# EAGLE schematic OSPID IO Board (EAGLE 6.4)
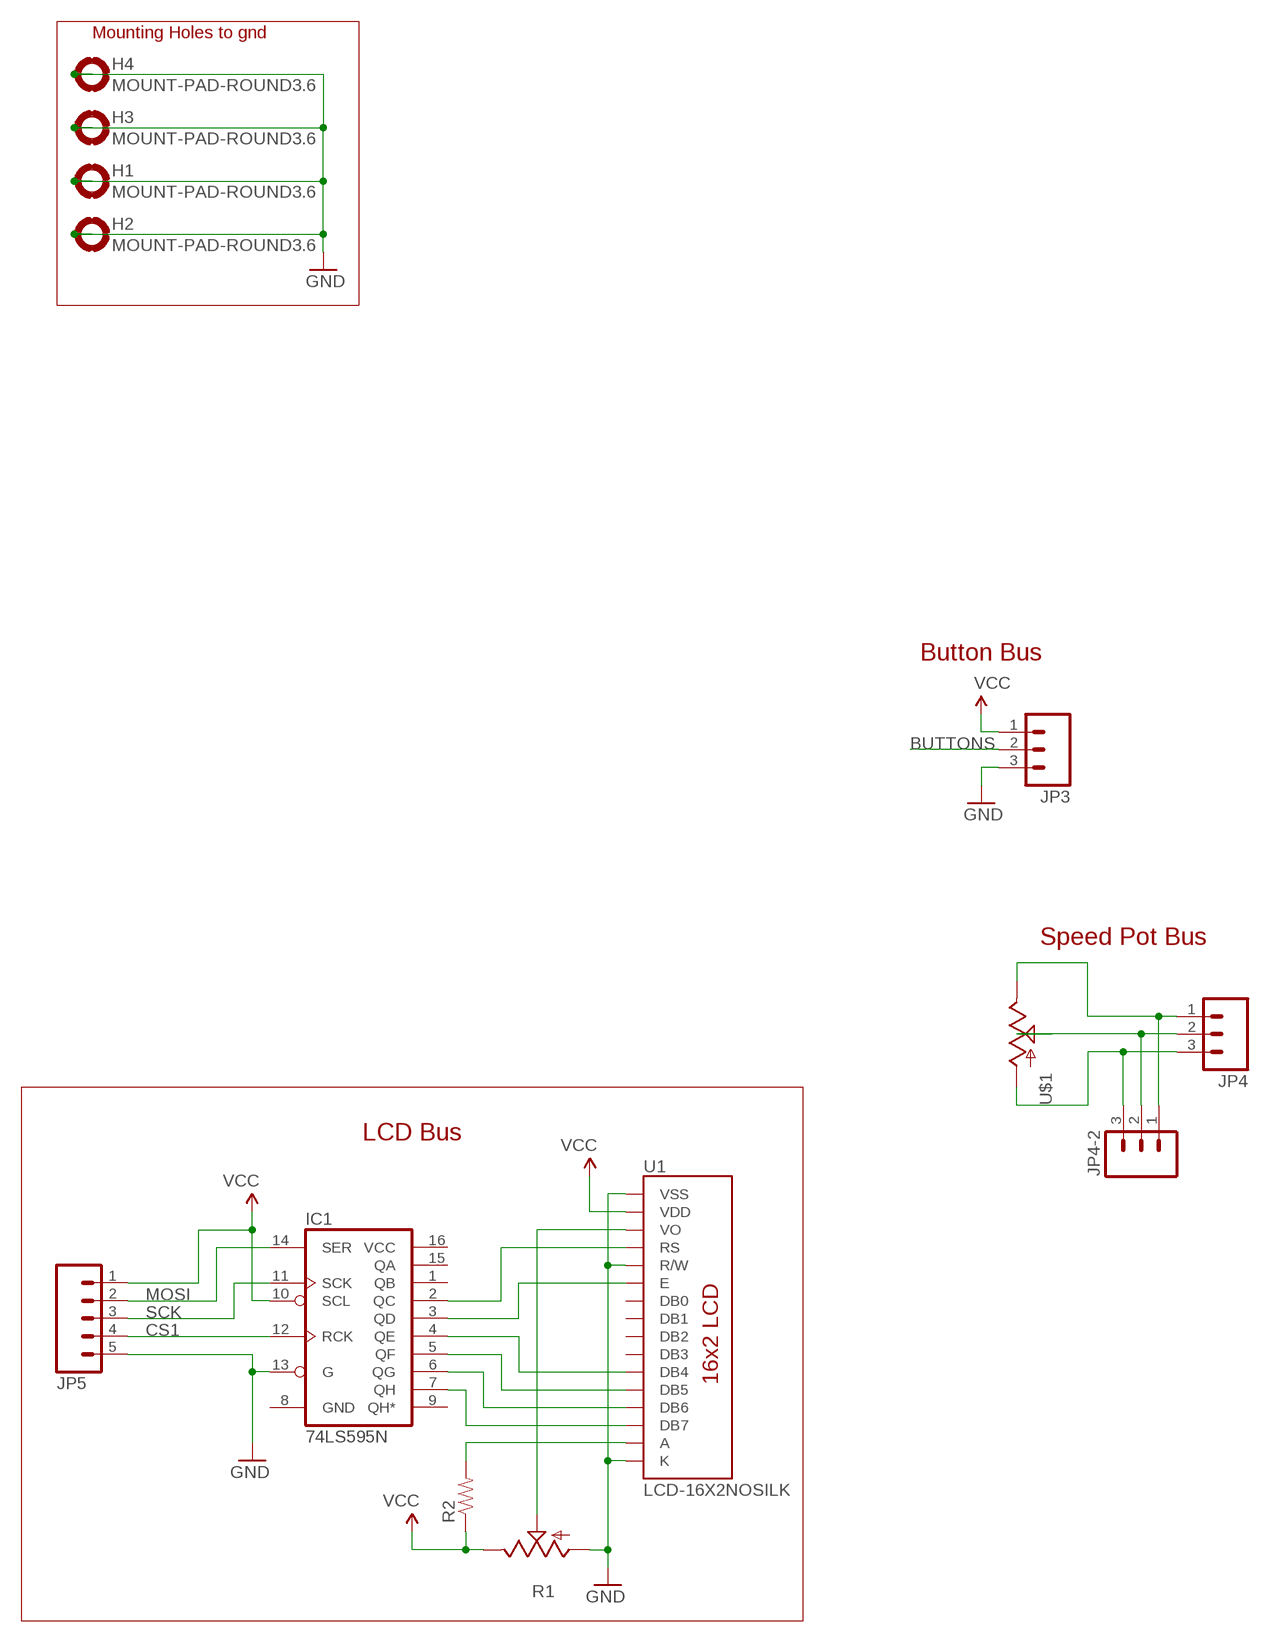
[diagram p0: schematic, sheet 1]

## Parts
H1  MOUNT-PAD-ROUND3.6  [3,6-PAD]
H2  MOUNT-PAD-ROUND3.6  [3,6-PAD]
H3  MOUNT-PAD-ROUND3.6  [3,6-PAD]
H4  MOUNT-PAD-ROUND3.6  [3,6-PAD]
IC1  74LS595N  [DIL16]
JP3  M03LOCK  [1X03_LOCK]
JP4  M03LOCK  [1X03_LOCK]
JP4-2  M03LOCK  [1X03_LOCK]
JP5  M05LOCK  [1X05_LOCK]
R1  POT_TRIM_US-B25U  [POT_B25U]
R2  RESISTORAXIAL-0.3  [AXIAL-0.3]
U1  LCD-16X2NOSILK  [LCD-16X2_NOSILK]
U$1  POT  [ALPS_POT]

## Nets
BUTTONS: JP3.2
CS1: IC1.12(RCK) JP5.4
GND: H1.B3,6(MOUNT) H2.B3,6(MOUNT) H3.B3,6(MOUNT) H4.B3,6(MOUNT) IC1.13(G) JP3.3 JP5.5 R1.A U1.1(VSS) U1.5(R/W) U1.16(K)
MOSI: IC1.14(SER) JP5.2
N$1: JP4-2.3 JP4.3 U$1.P$3(A)
N$2: R2.P$2 U1.15(A)
N$3: JP4-2.2 JP4.2 U$1.P$2(S)
N$4: JP4-2.1 JP4.1 U$1.P$1(E)
N$5: IC1.4(QE) U1.11(DB4)
N$6: IC1.2(QC) U1.4(RS)
N$7: IC1.3(QD) U1.6(E)
N$8: R1.S U1.3(VO)
N$9: IC1.5(QF) U1.12(DB5)
N$10: IC1.6(QG) U1.13(DB6)
N$11: IC1.7(QH) U1.14(DB7)
SCK: IC1.11(SCK) JP5.3
VCC: IC1.10(SCL) JP3.1 JP5.1 R1.E R2.P$1 U1.2(VDD)
Unconnected: IC1.1(QB) IC1.9(QH*) IC1.15(QA) U1.7(DB0) U1.8(DB1) U1.9(DB2) U1.10(DB3)

## Notes on the sheet
- Mounting Holes to gnd
- Button Bus
- Speed Pot Bus
- LCD Bus

## Power pins joined to a net without a drawn wire
GND: IC1.8(GND)
VCC: IC1.16(VCC)

## Library data of the parts
H1-H4 = holes:MOUNT-PAD-ROUND: MOUNTING PAD, round
IC1 = SparkFun-DigitalIC:74*595: 8-bit SHIFT REGISTER, output latch
JP3 JP4 JP4-2 = SparkFun-Connectors:M03: Header 3 Standard 3-pin 0.1" header. Use with straight break away headers (SKU : PRT-00116), right angle break away headers (PRT-00553), swiss pins (PRT-00743), machine pins (PRT-00117), and female headers (PRT-00115). Molex polarized connector foot print use with SKU : PRT-08232 with associated crimp pins and housings.
JP5 = SparkFun-Connectors:M05: Header 5 Standard 5-pin 0.1" header. Use with straight break away headers (SKU : PRT-00116), right angle break away headers (PRT-00553), swiss pins (PRT-00743), machine pins (PRT-00117), and female headers (PRT-00115). Molex polarized connector foot print use with SKU : PRT-08230 with associated crimp pins and housings.
R1 = HeaterMeterPI:POT_TRIM_US-: POTENTIOMETER
R2 = SparkFun-Resistors:RESISTOR: Resistor Basic schematic elements and footprints for 0603, 1206, and PTH resistors.
U1 = SparkFun-Displays:LCD-16X2: Standard text-only 16x2 parallel input LCD
U$1 = SparkFun-Electromechanical:POT

## Net classes
1 power: width 1.016 mm, clearance 0.305 mm